# Altium project IMU_REV_D_1.PrjPcb
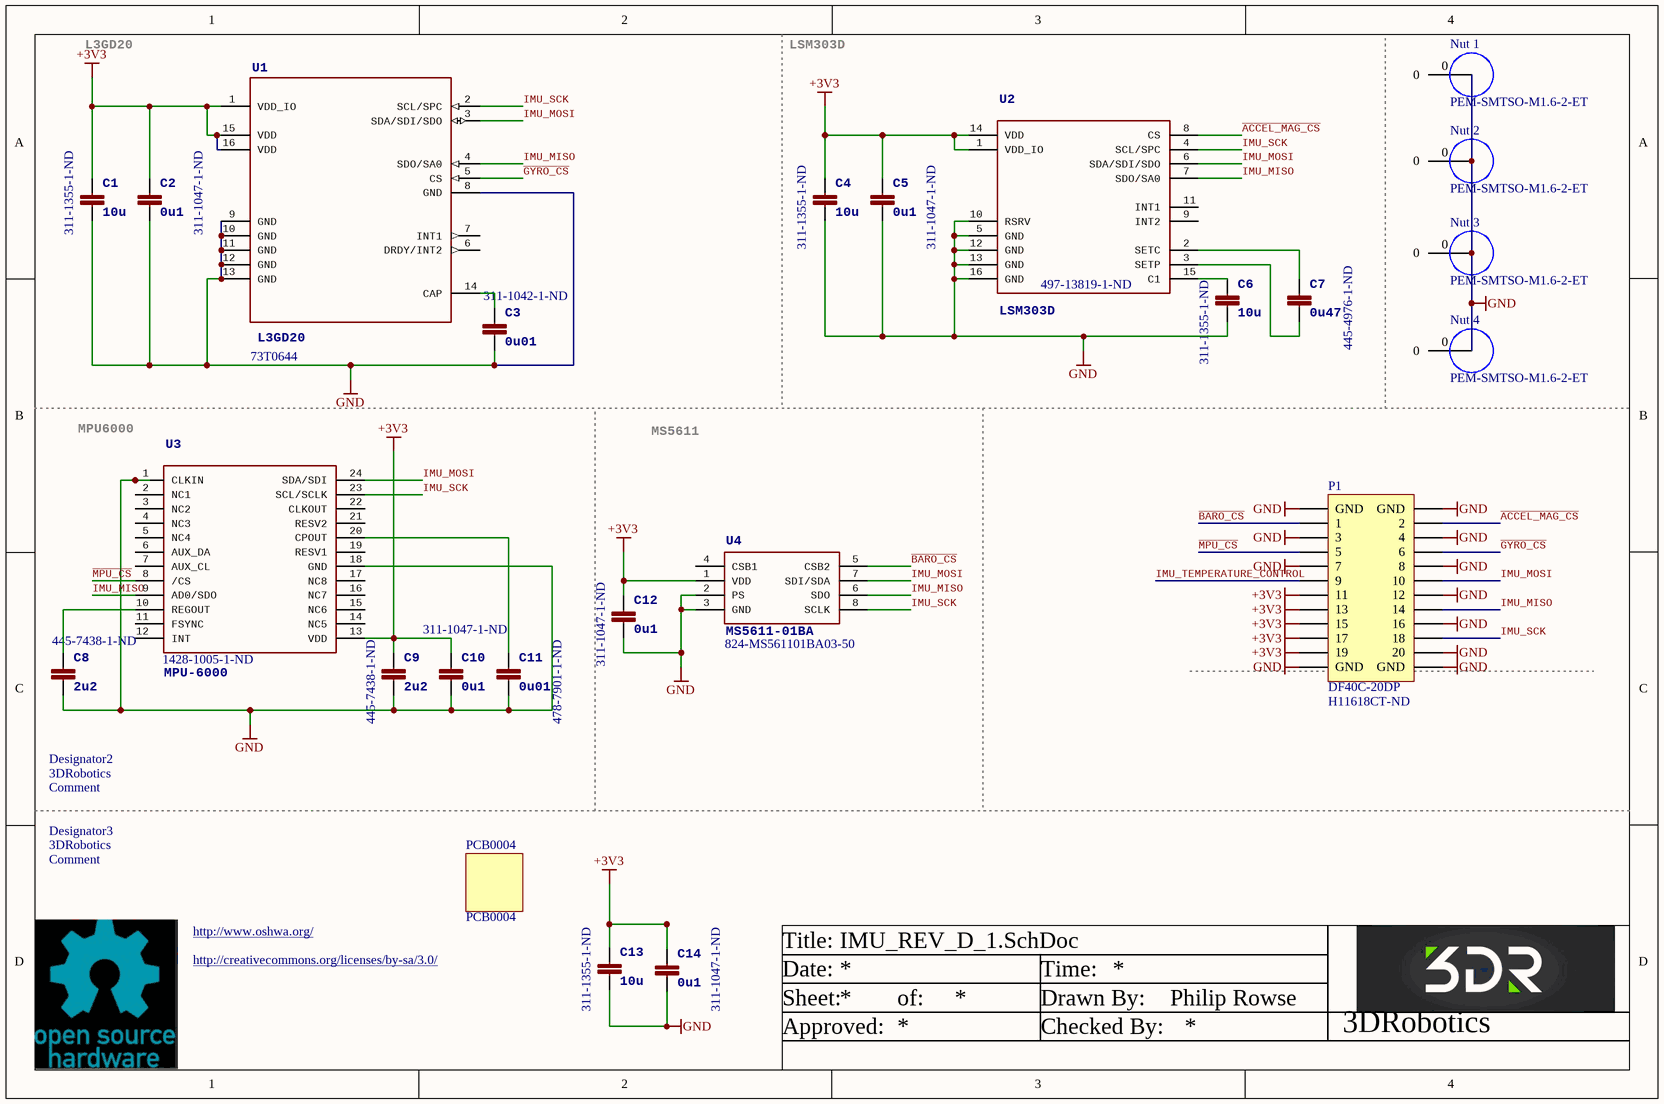
[diagram p0: IMU_REV_D_1.SchDoc]
1 sheet, 26 parts. Net scope: global (net labels, ports and power ports of the same name join across sheets).
Board file: IMU_REV_D_1.PcbDoc

## Sheet IMU_REV_D_1.SchDoc
size A4; DrawnBy: Philip Rowse

### Parts
C1  10u  Supplier Part Number 1: 311-1355-1-ND  [0805-CAP]
C2  0u1  Supplier Part Number 1: 311-1047-1-ND  [0402-CAP]
C3  0u01  Supplier Part Number 1: 311-1042-1-ND  [0402-CAP]
C4  10u  Supplier Part Number 1: 311-1355-1-ND  [0805-CAP]
C5  0u1  Supplier Part Number 1: 311-1047-1-ND  [0402-CAP]
C6  10u  Supplier Part Number 1: 311-1355-1-ND  [0805-CAP]
C7  0u47  Supplier Part Number 1: 445-4976-1-ND  [0402-CAP]
C8  2u2  Supplier Part Number 1: 445-7438-1-ND  [0603-CAP]
C9  2u2  Supplier Part Number 1: 445-7438-1-ND  [0603-CAP]
C10  0u1  Supplier Part Number 1: 311-1047-1-ND  [0402-CAP]
C11  0u01  Supplier Part Number 1: 478-7901-1-ND  [0603-CAP]
C12  0u1  Supplier Part Number 1: 311-1047-1-ND  [0402-CAP]
C13  10u  Supplier Part Number 1: 311-1355-1-ND  [0805-CAP]
C14  0u1  Supplier Part Number 1: 311-1047-1-ND  [0402-CAP]
Designator2  Comment  [3DR_SMALL]
Designator3  Comment  [3DR_SMALL]
Nut_1  PEM-SMTSO-M1.6-2-ET  [PEM-SMTSO-M1.6-2-ET]
Nut_2  PEM-SMTSO-M1.6-2-ET  [PEM-SMTSO-M1.6-2-ET]
Nut_3  PEM-SMTSO-M1.6-2-ET  [PEM-SMTSO-M1.6-2-ET]
Nut_4  PEM-SMTSO-M1.6-2-ET  [PEM-SMTSO-M1.6-2-ET]
P1  DF40C-20DP  Supplier Part Number 1: H11618CT-ND  [DF40C-20-DP]
PCB0004  PCB0004
U1  L3GD20  Supplier Part Number 1: 73T0644  [L3GD20]
U2  LSM303D  Supplier Part Number 1: 497-13819-1-ND  [LSM303D]
U3  MPU-6000  Supplier Part Number 1: 1428-1005-1-ND  [QFN-24]
U4  MS5611-01BA  Supplier Part Number 1: 824-MS561101BA03-50  [MS5611-01BA]

### Nets
+3V3: C1.P$1 C2.P$1 C4.P$1 C5.P$1 C9.P$1 C10.P$1 C12.P$1 C13.P$1 C14.P$1 P1.11 P1.13 P1.15 P1.17 P1.19 U1.1(VDD_IO) U1.15(VDD) U1.16(VDD) U2.1(VDD_IO) U2.14(VDD) U3.13(VDD) U4.1(VDD)
GND: C1.P$2 C2.P$2 C3.P$2 C4.P$2 C5.P$2 C6.P$2 C8.P$2 C9.P$2 C10.P$2 C11.P$2 C12.P$2 C13.P$2 C14.P$2 Nut_1.0 Nut_2.0 Nut_3.0 Nut_4.0 P1.3 P1.4 P1.7 P1.8 P1.12 P1.16 P1.20 P1.21(GND) P1.22(GND) P1.23(GND) P1.24(GND) U1.8(GND) U1.9(GND) U1.10(GND) U1.11(GND) U1.12(GND) U1.13(GND) U2.5(GND) U2.10(RSRV) U2.12(GND) U2.13(GND) U2.16(GND) U3.1(CLKIN) U3.18(GND) U4.2(PS) U4.3(GND)
~{ACCEL_MAG_CS}: P1.2 U2.8(CS)
~{BARO_CS}: P1.1 U4.5(CSB2)
~{GYRO_CS}: P1.6 U1.5(CS)
IMU_MISO: P1.14 U1.4(SDO/SA0) U2.7(SDO/SA0) U3.9(AD0/SDO) U4.6(SDO)
IMU_MOSI: P1.10 U1.3(SDA/SDI/SDO) U2.6(SDA/SDI/SDO) U3.24(SDA/SDI) U4.7(SDI/SDA)
IMU_SCK: P1.18 U1.2(SCL/SPC) U2.4(SCL/SPC) U3.23(SCL/SCLK) U4.8(SCLK)
IMU_TEMPERATURE_CONTROL: P1.9
~{MPU_CS}: P1.5 U3.8(/CS)
NetC3_P$1: C3.P$1 U1.14(CAP)
NetC6_P$1: C6.P$1 U2.15(C1)
NetC7_P$1: C7.P$1 U2.2(SETC)
NetC7_P$2: C7.P$2 U2.3(SETP)
NetC8_P$1: C8.P$1 U3.10(REGOUT)
NetC11_P$1: C11.P$1 U3.20(CPOUT)

Not connected (* = marked no-connect by the designer): U1 6(DRDY/INT2) 7(INT1); U2 9(INT2) 11(INT1); U3 2(NC1) 3(NC2) 4(NC3) 5(NC4) 6(AUX_DA) 7(AUX_CL) 11(FSYNC) 12(INT) 14(NC5) 15(NC6) 16(NC7) 17(NC8) 19(RESV1) 21(RESV2) 22(CLKOUT); U4 4(CSB1)

### Notes on the sheet
- L3GD20
- LSM303D
- MPU6000
- MS5611
- http://www.oshwa.org/
- http://creativecommons.org/licenses/by-sa/3.0/
- Title:
- Date:
- Time:
- Sheet:
- Approved:
- of:
- Drawn By:
- Checked By:
- 3DRobotics
- (in symbol 3DR-Logo Large) 3DRobotics

### Library data of the parts
C1 C4 C6 C13 = CAPACITOR-0805: Capacitor, 10uF, 10V, Y5V, 0805, Ceramic; PARTNO: CC0805ZKY5V6BB106; 3DR_PARTNO: ECM0713; Supplier 1: Digi-Key; Value: 10u
C2 C5 C10 C12 C14 = CAPACITOR-0402: Capacitor, 0.1uF, 16V, Y5V, 0402, Ceramic; PARTNO: CC0402ZRY5V7BB104; 3DR_PARTNO: ECM0700; Supplier 1: Digi-Key; Value: 0u1
C3 = CAPACITOR-0402: Capacitor, 10000pF, 16V, 10%, X7R, 0402, Ceramic; PARTNO: CC0402KRX7R7BB103; 3DR_PARTNO: ECM0711; Supplier 1: Digi-Key; Value: 10000pF
C7 = CAPACITOR-0402: Capacitor,  0.47uF, 16V, 10%, X5R, 0402, Ceramic; PARTNO: C1005X5R1C474K050BC; 3DR_PARTNO: ECM0704; Supplier 1: Digi-Key; Value: 0u47
C8 C9 = CAPACITOR-0603: Capacitor, 2.2uF, 16V, 10%, X6S, 0603, Ceramic; PARTNO: C1608X6S1C225K080AC; 3DR_PARTNO: ECM0619; Supplier 1: Digi-Key; Value: 2u2
C11 = CAPACITOR-0603: Capacitor, 10000pF, 25V, 5%, X7R, 0603, Ceramic; PARTNO: 06033C103JAT2A; 3DR_PARTNO: ECM0620; Supplier 1: Digi-Key; Value: 10000pF
Designator2 Designator3 = 3DR-Logo Large: PARTNO: DO NOT FIT
Nut_1-Nut_4 = PEM-SMTSO-M1.6-2-ET: Fastener, M1.6x2mm, SMTSO, Carbon Steel; Mfg Part Num (Alternate): Check; Manufacturer 1: PennEngineering; 3DR_PARTNO: PRT0438; Manufacturer Part Number 1: PEM-SMTSO-M1.6-2-ET; Supplier Unit Price 1: 0.7; Supplier Part Number 1: PEM-SMTSO-M1.6-2-ET; Supplier 1: PennEngineering
P1 = DF40C-20DP: Connector, HDR, 20Pos, 0.4mm, SMD, GOLD; 3DR_PARTNO: ECM0510; Value: DF40C-20DP-0.4V(51); LatestRevisionDate: 17-Jul-2002; LatestRevisionNote: Re-released for DXP Platform.; Publisher: Altium Limited; Supplier 1: Digi-Key
PCB0004 = PCB_0004: IMU PCB; 3DR_PARTNO: PCB0004; Value: PCB0004
U1 = L3GD20: Sensor, Low-power, Three-axis, Angular rate; 3DR_PARTNO: ECM0827; MFGPN: L3GD20; Supplier 1: Newark
U2 = LSM303D: Module, 3D Accelerometer, 3D Magnetometer; 3DR_PARTNO: ECM0828; DATASHEET: http://www.st.com/internet/com/TECHNICAL_RESOURCES/TECHNICAL_LITERATURE/DATASHEET/DM00057547.pdf; LINK: http://www.st.com/internet/analog/product/253884.jsp; MFGPN: LSM303D; Supplier 1: Digi-Key
U3 = MPU-6000: 3 Axis Accel, 3Axis Gyro; 3DR_PARTNO: ECM0834; DATASHEET: http://invensense.com/mems/gyro/documents/PS-MPU-6000A-00_v1.0.pdf; LINK: http://invensense.com/mems/gyro/mpu6000.html; MFGPN: MPU-6000; Supplier 1: Digi-Key
U4 = MS5611-01BA: Board, Digital pressure sensor I2C/SPI; 3DR_PARTNO: ECM0835; DATASHEET: http://www.meas-spec.com/downloads/MS5611-01BA01.pdf; LINK: http://www.meas-spec.com/product/t_product.aspx?id=8503#; MFGPN: MS5611-01BA; PARTNO: MS5611-01BA; Supplier 1: Mouser

## Assembly variants
IMU_REV_D: not fitted Designator2 Designator3